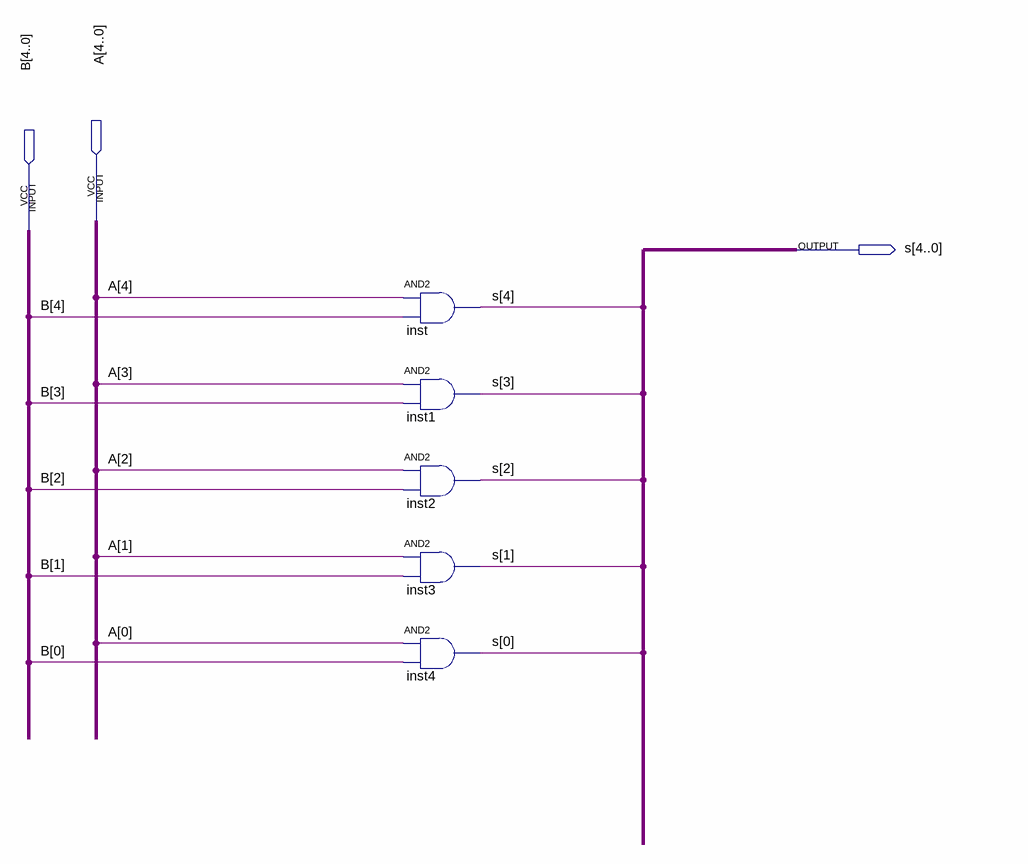
[diagram p0: schematic sheet]
// Quartus schematic AANDB.bdf as structural Verilog: 5 symbols, 3 pins
module AANDB (
  input  [4:0] A,
  input  [4:0] B,
  output [4:0] s
);

  and inst (s[4], A[4], B[4]);
  and inst1 (s[3], A[3], B[3]);
  and inst2 (s[2], A[2], B[2]);
  and inst3 (s[1], A[1], B[1]);
  and inst4 (s[0], A[0], B[0]);
endmodule
